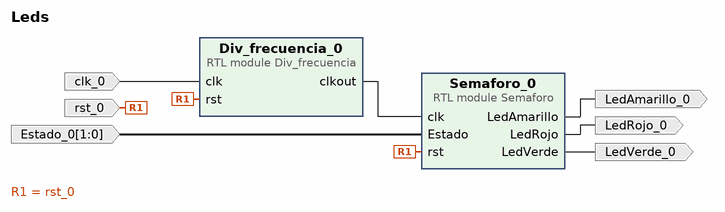
[diagram p0: block diagram of the top level]
# Vivado block design Leds, xc7a100tcsg324-1, Vivado 2019.1
create_bd_design Leds

create_bd_port -dir I -type rst rst_0
create_bd_port -dir I -from 1 -to 0 Estado_0
create_bd_port -dir O LedVerde_0
create_bd_port -dir O LedAmarillo_0
create_bd_port -dir O LedRojo_0
create_bd_port -dir I -type clk clk_0

create_bd_cell -type module -reference Div_frecuencia Div_frecuencia_0
create_bd_cell -type module -reference Semaforo Semaforo_0

# ---- connections ----

connect_bd_net -net rst_0_1 [get_bd_ports rst_0] [get_bd_pins Div_frecuencia_0/rst] [get_bd_pins Semaforo_0/rst]
connect_bd_net [get_bd_pins Div_frecuencia_0/clkout] [get_bd_pins Semaforo_0/clk]
connect_bd_net -net Estado_0_1 [get_bd_ports Estado_0] [get_bd_pins Semaforo_0/Estado]
connect_bd_net [get_bd_pins Semaforo_0/LedVerde] [get_bd_ports LedVerde_0]
connect_bd_net [get_bd_pins Semaforo_0/LedAmarillo] [get_bd_ports LedAmarillo_0]
connect_bd_net [get_bd_pins Semaforo_0/LedRojo] [get_bd_ports LedRojo_0]
connect_bd_net -net clk_0_1 [get_bd_ports clk_0] [get_bd_pins Div_frecuencia_0/clk]

validate_bd_design
save_bd_design
